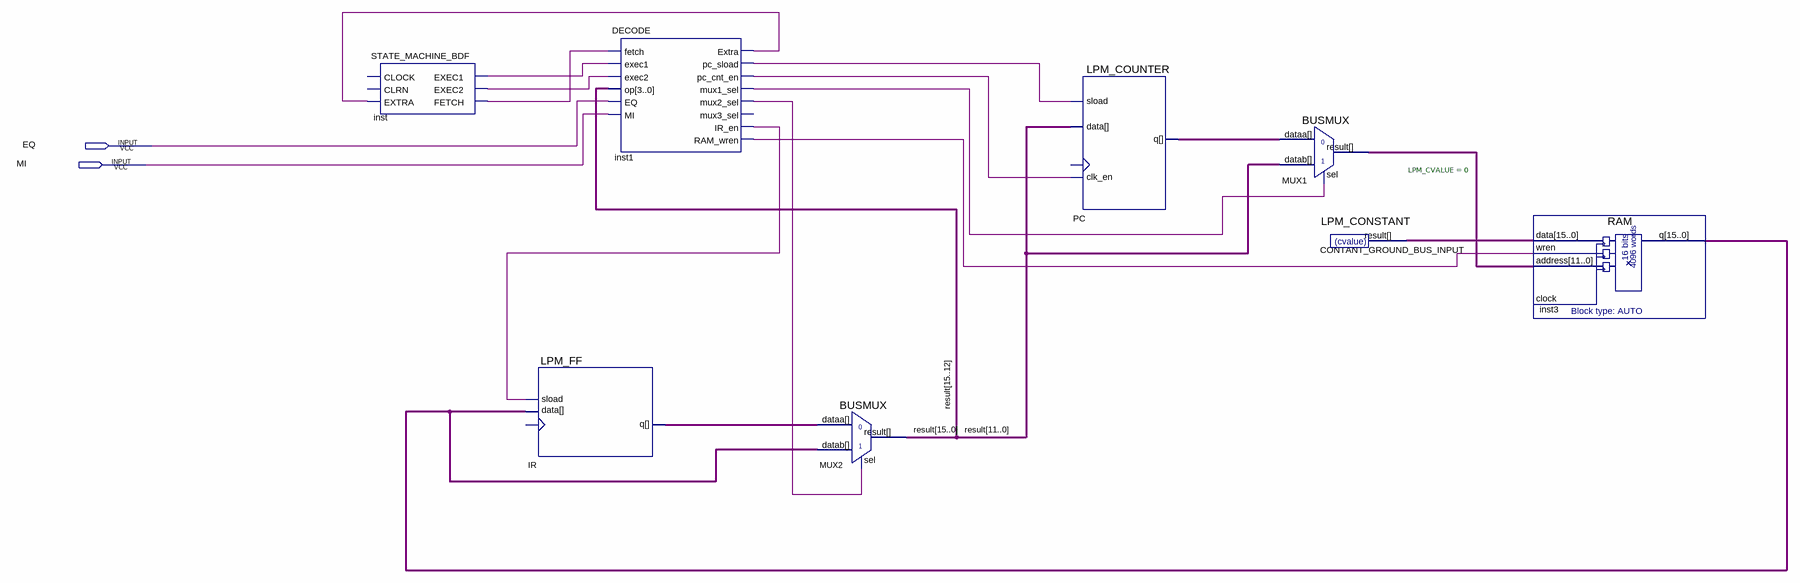
[diagram p0: schematic sheet]
// Quartus schematic TASK4.bdf as structural Verilog: 8 symbols, 2 pins
module TASK4 (
  input  EQ,
  input  MI
);

  wire inst1_extra, inst1_ir_en, inst1_mux1_sel, inst1_mux2_sel, inst1_pc_cnt_en, inst1_pc_sload,
       inst1_ram_wren, inst_exec1, inst_exec2, inst_fetch, IR_q, PC_q;
  wire [11:0] MUX1_result;
  wire [15:0] CONTANT_GROUND_BUS_INPUT_result, inst3_q, result;

  STATE_MACHINE_BDF inst (
    .EXTRA(inst1_extra), .EXEC1(inst_exec1), .EXEC2(inst_exec2), .FETCH(inst_fetch));  // open: CLOCK, CLRN
  LPM_FF IR (.data(inst3_q), .sload(inst1_ir_en), .q(IR_q));  // open: clock
  DECODE inst1 (
    .fetch(inst_fetch), .exec1(inst_exec1), .exec2(inst_exec2), .op(result[15:12]), .EQ(EQ), .MI(MI),
    .Extra(inst1_extra), .pc_sload(inst1_pc_sload), .pc_cnt_en(inst1_pc_cnt_en), .mux1_sel(inst1_mux1_sel),
    .mux2_sel(inst1_mux2_sel), .IR_en(inst1_ir_en), .RAM_wren(inst1_ram_wren));  // open: mux3_sel
  BUSMUX MUX2 (.datab(inst3_q), .sel(inst1_mux2_sel), .dataa(IR_q), .result(result));
  LPM_COUNTER PC (.clk_en(inst1_pc_cnt_en), .data(result[11:0]), .sload(inst1_pc_sload), .q(PC_q));  // open: clock
  BUSMUX MUX1 (.datab(result[11:0]), .sel(inst1_mux1_sel), .dataa(PC_q), .result(MUX1_result));
  LPM_CONSTANT #(.LPM_CVALUE(0)) CONTANT_GROUND_BUS_INPUT (.result(CONTANT_GROUND_BUS_INPUT_result));
  RAM inst3 (
    .data(CONTANT_GROUND_BUS_INPUT_result), .wren(inst1_ram_wren), .address(MUX1_result), .q(inst3_q));  // open: clock
endmodule
